# EAGLE design garage_monitor (EAGLE 6.4)
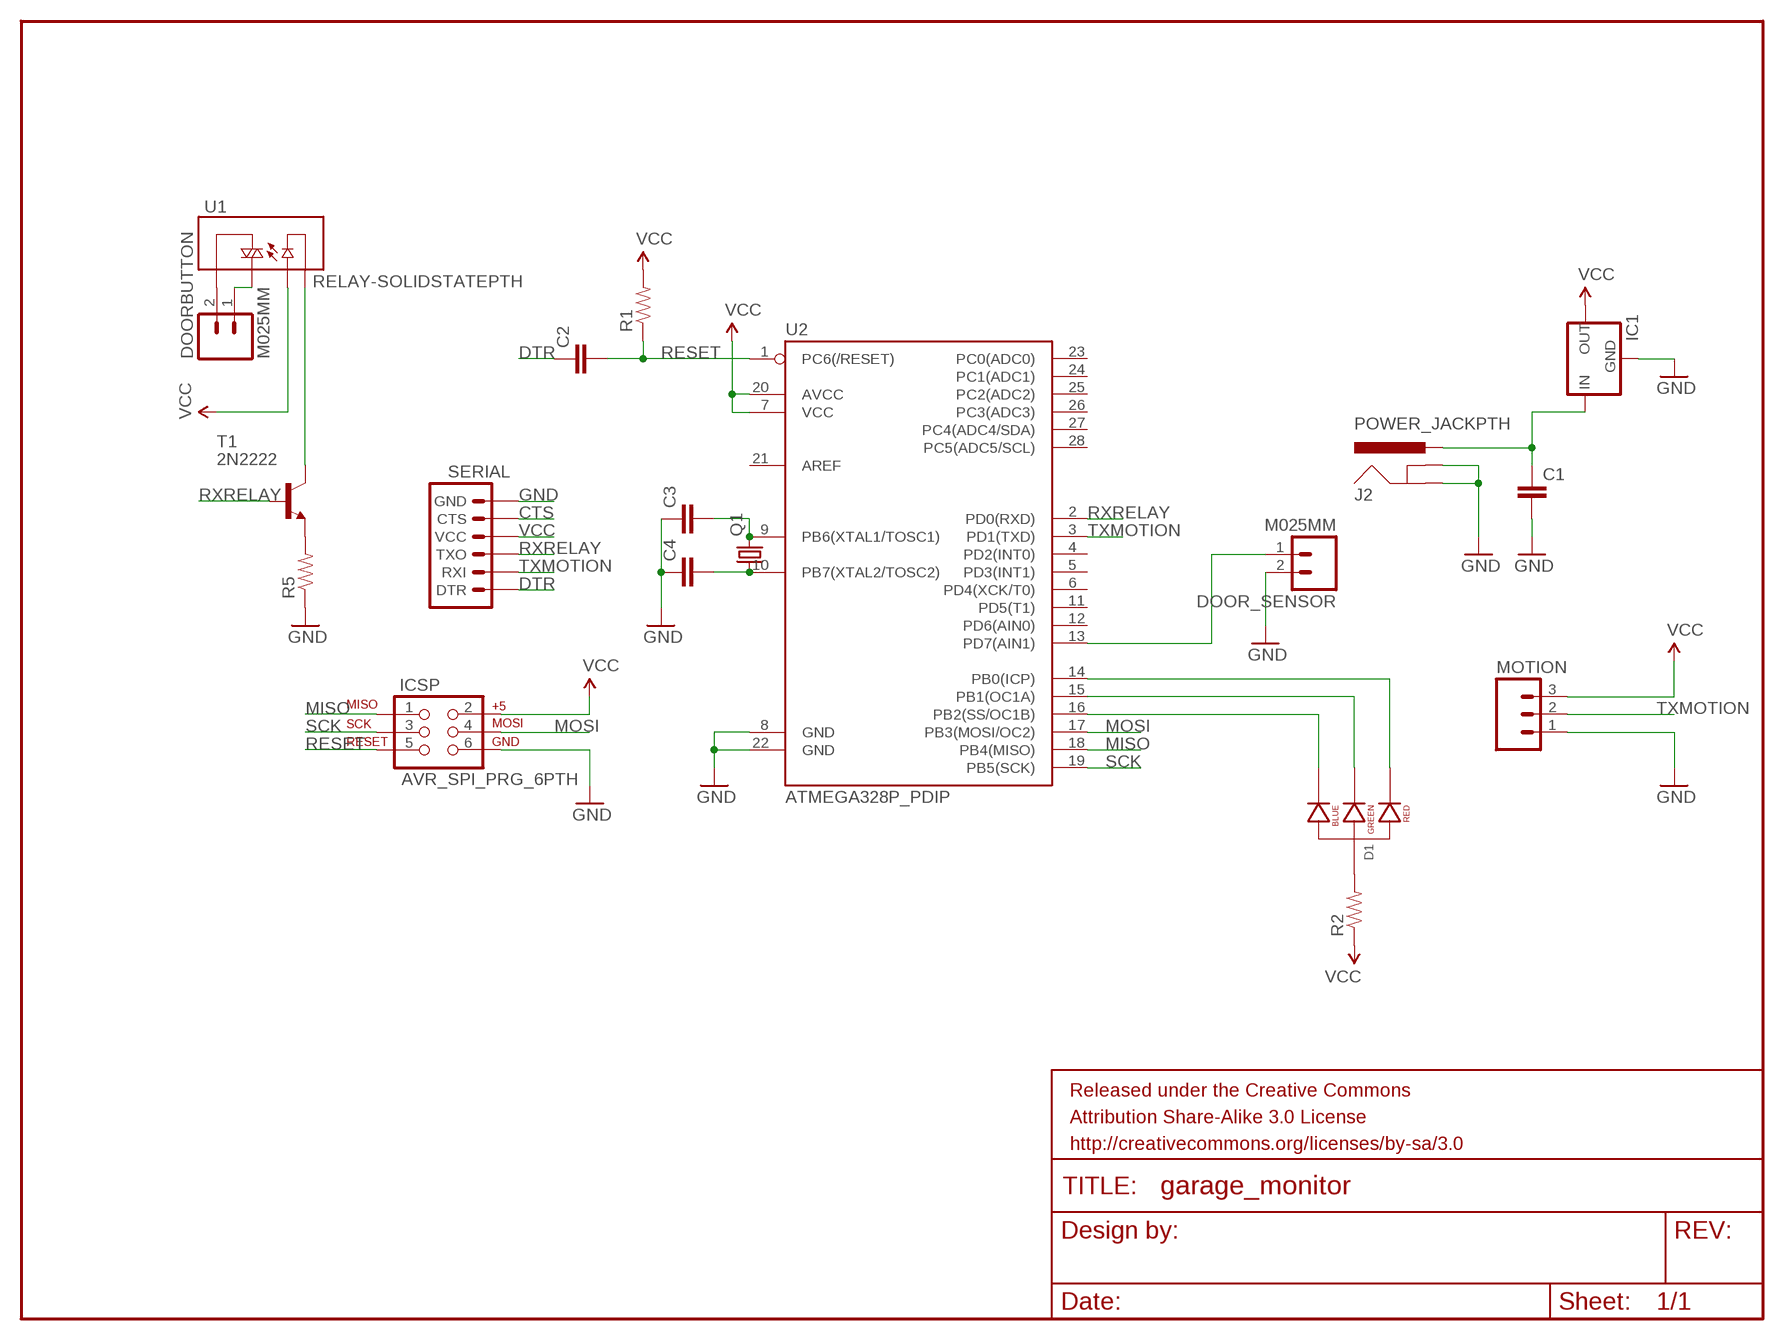
[diagram p0: schematic, sheet 1]

## Parts
C1  CAPPTH  [CAP-PTH-SMALL]
C2  CAPPTH  [CAP-PTH-SMALL]
C3  CAPEZ  [CAP-PTH-SMALLEZ]
C4  CAPEZ  [CAP-PTH-SMALLEZ]
D1  LED-RGB-CA-THRUCLEAR  [LED-RGB-THRU]
DOOR_SENSOR  M025MM  [SCREWTERMINAL-5MM-2]
DOORBUTTON  M025MM  [SCREWTERMINAL-5MM-2]
FRAME1  FRAME-LETTER  [CREATIVE_COMMONS]
IC1  V_REG_78XXSIDE  [78XXL]
ICSP  AVR_SPI_PRG_6PTH  [2X3]
J2  POWER_JACKPTH  [POWER_JACK_PTH]
MOTION  M03PTH  [1X03]
Q1  CRYSTALHC49S  [HC49/S]
R1  RESISTORPTH-1/4W  [AXIAL-0.4]
R2  RESISTORPTH-1/4W  [AXIAL-0.4]
R5  RESISTORPTH-1/4W  [AXIAL-0.4]
SERIAL  ARDUINO_SERIAL_PROGRAMPTH  [1X06]
T1  2N2222  [TO18]
U1  RELAY-SOLIDSTATEPTH  [RELAY-S108T02]
U2  ATMEGA328P_PDIP  [DIL28-3]

## Nets
CTS: SERIAL.5(CTS)
DTR: C2.1 SERIAL.1(DTR)
GND: C1.2 C3.1 C4.1 DOOR_SENSOR.2 IC1.GND ICSP.6 J2.GND J2.GNDBREAK MOTION.1 R5.P$1 SERIAL.6(GND) U2.8(GND) U2.22(GND)
MISO: ICSP.1 U2.18(PB4(MISO))
MOSI: ICSP.4 U2.17(PB3(MOSI/OC2))
N$1: DOOR_SENSOR.1 U2.13(PD7(AIN1))
N$2: R5.P$2 T1.1(E)
N$3: T1.3(C) U1.4(-)
N$8: D1.2(ANODE) R2.P$2
N$9: C3.2 Q1.2 U2.9(PB6(XTAL1/TOSC1))
N$10: C4.2 Q1.1 U2.10(PB7(XTAL2/TOSC2))
N$11: D1.4(BLUE_CATHODE) U2.16(PB2(SS/OC1B))
N$12: D1.3(GREEN_CATHODE) U2.15(PB1(OC1A))
N$13: D1.1(RED_CATHODE) U2.14(PB0(ICP))
N$15: DOORBUTTON.2 U1.1(T1)
N$16: DOORBUTTON.1 U1.2(T2)
N$18: C1.1 IC1.IN J2.PWR
RESET: C2.2 ICSP.5 R1.P$1 U2.1(PC6(/RESET))
RXRELAY: SERIAL.3(TXO) T1.2(B) U2.2(PD0(RXD))
SCK: ICSP.3 U2.19(PB5(SCK))
TXMOTION: MOTION.2 SERIAL.2(RXI) U2.3(PD1(TXD))
VCC: IC1.OUT ICSP.2 MOTION.3 R1.P$2 R2.P$1 SERIAL.4(VCC) U1.3(+) U2.7(VCC) U2.20(AVCC)
Unconnected: U2.4(PD2(INT0)) U2.5(PD3(INT1)) U2.6(PD4(XCK/T0)) U2.11(PD5(T1)) U2.12(PD6(AIN0)) U2.21(AREF) U2.23(PC0(ADC0)) U2.24(PC1(ADC1)) U2.25(PC2(ADC2)) U2.26(PC3(ADC3)) U2.27(PC4(ADC4/SDA)) U2.28(PC5(ADC5/SCL))

## Library data of the parts
C1-C4 = SparkFun-Capacitors:CAP: Capacitor Standard 0603 ceramic capacitor, and 0.1" leaded capacitor.
D1 = SparkFun-LED:LED-RGB-CA-THRU: RGB Through-hole common anode SparkFun store front COM-10821 (diffuse) COM-10820 (clear); PROD_ID: DIO-10631
DOOR_SENSOR DOORBUTTON = SparkFun-Connectors:M02: Standard 2-pin 0.1" header. Use with - straight break away headers ( PRT-00116) - right angle break away headers (PRT-00553) - swiss pins (PRT-00743) - machine pins (PRT-00117) - female headers (PRT-00115) Molex polarized connector foot print use with: PRT-08233 with associated crimp pins and housings. 2.54_SCREWTERM for use with PRT-10571. 3.5mm Screw Terminal footprints for PRT-08084 5mm Screw Terminal footprints for use with PRT-08433
FRAME1 = SparkFun-Aesthetics:FRAME-LETTER: Schematic Frame Standard 8.5x11 US Letter frame
IC1 = SparkFun-PowerIC:V_REG_78XX: Voltage Regulator Standard 7805 5V regulator. IGO (Input Ground Output). Spark Fun Electronics SKU : COM-00107
ICSP = SparkFun-Connectors:AVR_SPI_PRG_6: AVR ISP 6 Pin This is the reduced ISP connector for AVR programming. Common on Arduino. This footprint will take up less PCB space and can be used with a 10-pin to 6-pin adapter such as SKU: BOB-08508
J2 = SparkFun-Connectors:POWER_JACK: Power Jack This is the standard 5.5mm barrel jack for power. The PTH is the most common, proven, reliable, footprint. The Slot footprint only works if the mill layer is transmitted to the PCB fab house so be warned. Mating wall wart : TOL-00298 (and others); PROD_ID: PRT-00119
MOTION = SparkFun-Connectors:M03: Header 3 Standard 3-pin 0.1" header. Use with straight break away headers (SKU : PRT-00116), right angle break away headers (PRT-00553), swiss pins (PRT-00743), machine pins (PRT-00117), and female headers (PRT-00115). Molex polarized connector foot print use with SKU : PRT-08232 with associated crimp pins and housings.
Q1 = crystal:CRYSTAL: CRYSTAL; OC_FARNELL: 1667008; OC_NEWARK: unknown
R1 R2 R5 = SparkFun-Resistors:RESISTOR: Resistor Basic schematic elements and footprints for 0603, 1206, and PTH resistors.
SERIAL = SparkFun-Connectors:ARDUINO_SERIAL_PROGRAM: FTDI connector footprints
T1 = transistor:2N2222: NPN TRANSISTOR
U1 = SparkFun-Electromechanical:RELAY-SOLIDSTATE: SPST SS relay
U2 = SparkFun-DigitalIC:ATMEGA328P_PDIP: uC used in the Arduino 32kb flash, 1k EEPROM, 2k SRAM This is the through-hole version of this chip.

## Board
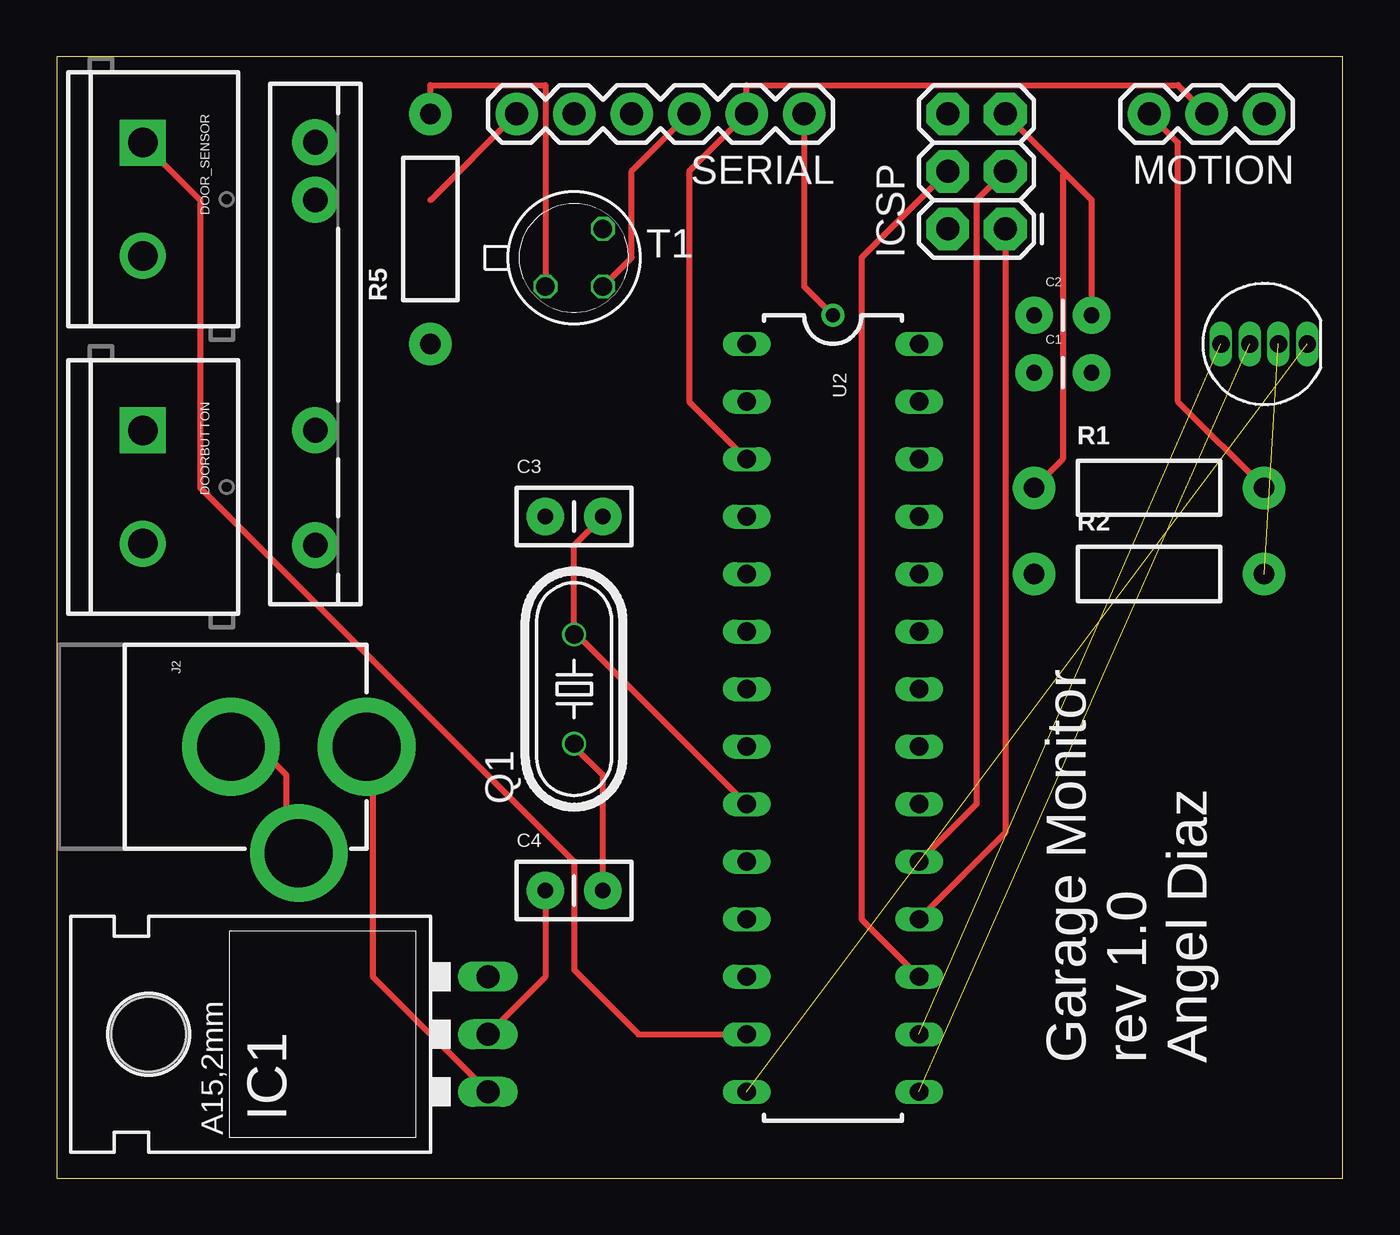
[diagram p1: board, top side]
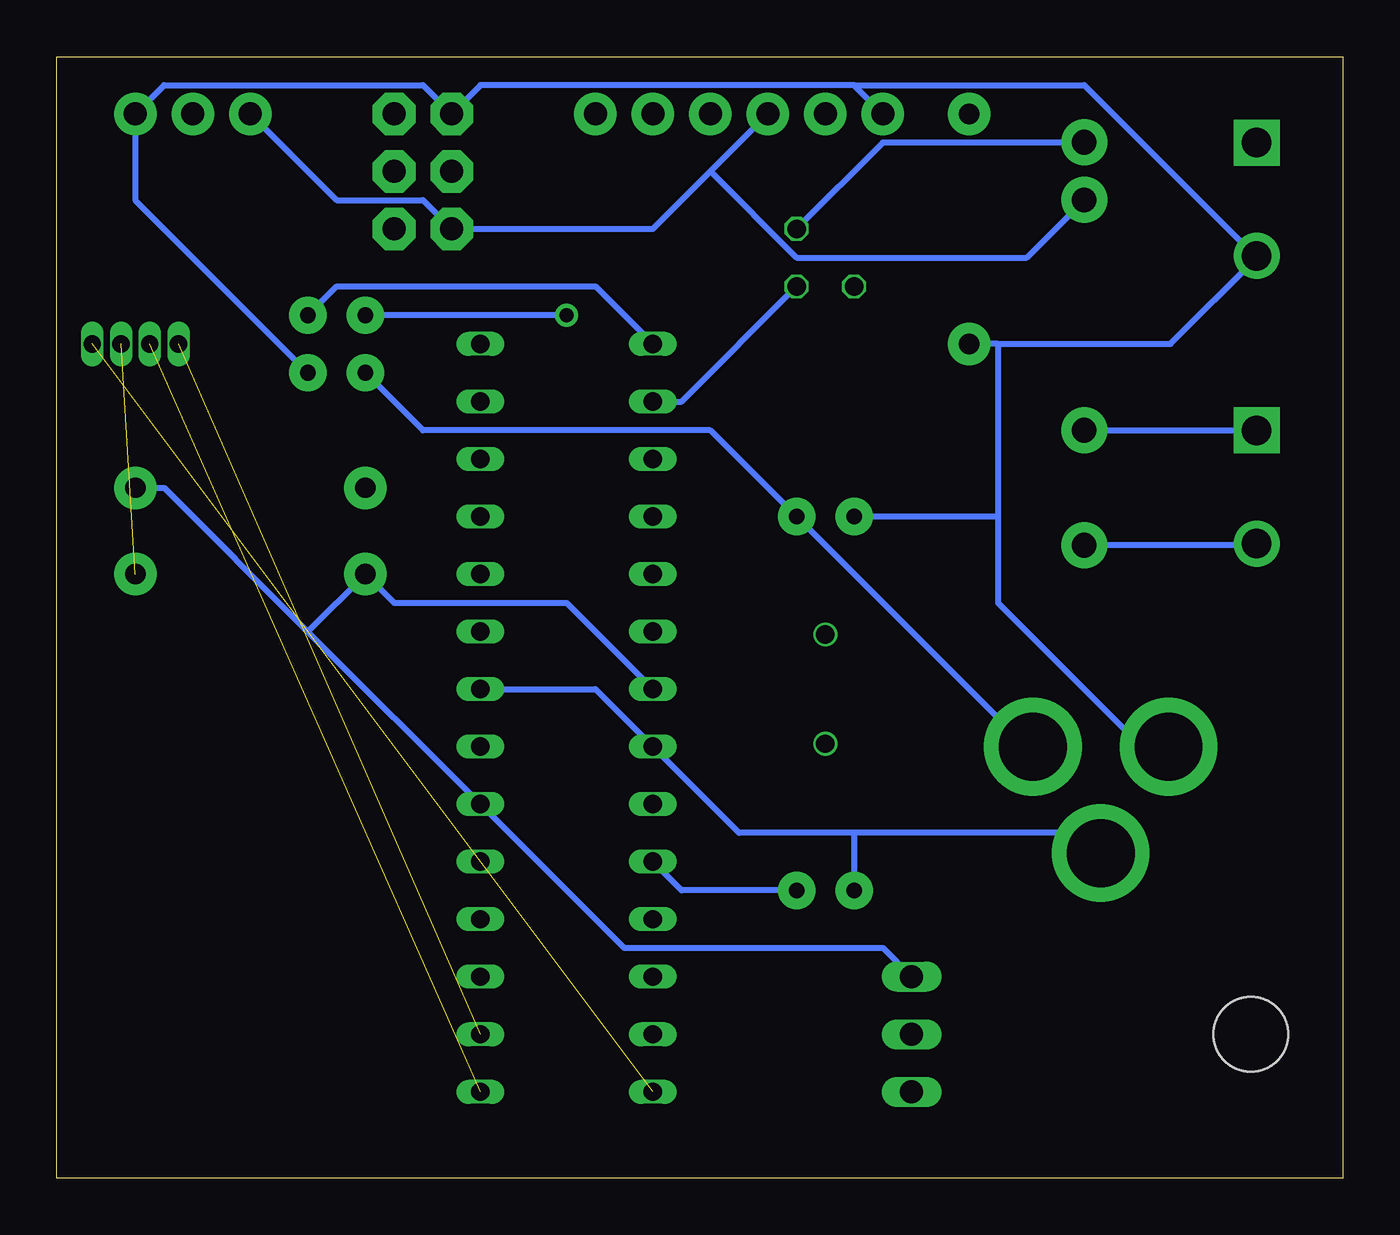
[diagram p2: board, bottom side, seen from below]

Size 56.82 x 49.52 mm. Coordinates in mm from the lower left corner, seen from the top.
Outline: 0,0 56.82,0 56.82,49.52 0,49.52 0,0
Copper layers (1*16): Top 0.035mm / dielectric 1.5mm / Bottom 0.035mm
Design rules "default *": minimum track width 10mil, minimum drill 24mil, track to track 8mil, track to pad 8mil, pad to pad 8mil, via to via 8mil, smd to smd 8mil, copper to edge 40mil, drill to drill 8mil, minimum pad ring 0mil, minimum via ring 8mil, stop-mask expansion 4mil, vias tented up to drill 0mil, thermal gap 10mil

### Footprints (pad centres in the part's own frame; a part is rotated, then mirrored left to right if it is on the bottom)
CAP-PTH-SMALL = drill 0.7 pad 1.651: 1 0,0; 2 2.54,0
CAP-PTH-SMALLEZ = drill 0.7 pad 1.651: 1 0,0; 2 2.54,0
LED-RGB-THRU = drill 0.762 pad 0.889 long: 1 1.905,0; 2 0.635,0; 3 -0.635,0; 4 -1.905,0
SCREWTERMINAL-5MM-2 = drill 1.3 pad 2.032 square: 1 0,0 | drill 1.3 pad 2.032: 2 5,0
78XXL = drill 1.016 long: GND 0,-3.81; IN -2.54,-3.81; OUT 2.54,-3.81 | hole 3.302: 0,11.176
2X3 = drill 1.016 pad 1.88 octagon: 1 0,0; 2 0,2.54; 3 2.54,0; 4 2.54,2.54; 5 5.08,0; 6 5.08,2.54
POWER_JACK_PTH = drill 2.997 pad 4.318: GND 0,7.7; GNDBREAK 4.7,10.7; PWR 0,13.7
1X03 = drill 1.016 pad 1.88: 1 0,0; 2 2.54,0; 3 5.08,0
HC49/S = drill 0.813: 1 -2.413,0; 2 2.413,0
AXIAL-0.4 = drill 0.9 pad 1.88: P$1 -5.08,0; P$2 5.08,0
1X06 = drill 1.016 pad 1.88: 1 0,0; 2 2.54,0; 3 5.08,0; 4 7.62,0; 5 10.16,0; 6 12.7,0
TO18 = drill 0.813 octagon: 1 -1.27,-1.27; 2 1.27,-1.27; 3 1.27,1.27
RELAY-S108T02 = drill 1.1 pad 2.032: 1 -8.88,0; 2 -3.8,0; 3 6.36,0; 4 8.9,0
DIL28-3 = drill 0.813 long: 1 -16.51,-3.81; 2 -13.97,-3.81; 3 -11.43,-3.81; 4 -8.89,-3.81; 5 -6.35,-3.81; 6 -3.81,-3.81; 7 -1.27,-3.81; 8 1.27,-3.81; 9 3.81,-3.81; 10 6.35,-3.81; 11 8.89,-3.81; 12 11.43,-3.81; 13 13.97,-3.81; 14 16.51,-3.81; 15 16.51,3.81; 16 13.97,3.81; 17 11.43,3.81; 18 8.89,3.81; 19 6.35,3.81; 20 3.81,3.81; 21 1.27,3.81; 22 -1.27,3.81; 23 -3.81,3.81; 24 -6.35,3.81; 25 -8.89,3.81; 26 -11.43,3.81; 27 -13.97,3.81; 28 -16.51,3.81

### Placement (x,y rotation side)
C1  43.18,35.56 0 top
C2  43.18,38.1 0 top
C3  21.59,29.21 0 top
C4  21.59,12.7 0 top
D1  53.34,36.83 0 top
DOOR_SENSOR  3.81,45.72 270 top
DOORBUTTON  3.81,33.02 270 top
FRAME1  21.59,-38.1 0 top  (outside the outline)
IC1  15.24,6.35 90 top
ICSP  41.91,41.91 90 top
J2  0,19.05 270 top
MOTION  53.34,46.99 180 top
Q1  22.86,21.59 90 top
R1  48.26,30.48 0 top
R2  48.26,26.67 0 top
R5  16.51,41.91 90 top
SERIAL  33.02,46.99 180 top
T1  22.86,40.64 0 top
U1  11.43,36.83 90 top
U2  34.29,20.32 270 top

### Tracks (layer width: path | path; a pad name or v marks a point on that pad's centre or on a via)
DTR  (via drill 0.61)
  Top 0.254: v34.29,38.1 33.02,39.37 SERIAL.1
  Bottom 0.254: v34.29,38.1 C2.1
GND
  Top 0.254: IC1.GND 21.59,8.89 C4.1 | J2.GND 8.89,19.05 10.16,17.78 10.16,15.24 J2.GNDBREAK | 16.51,43.18 SERIAL.6
  Bottom 0.254: U2.22 33.02,21.59 U2.8 26.67,15.24 21.59,15.24 | 21.59,15.24 11.43,15.24 J2.GNDBREAK | 21.59,15.24 C4.1 | C1.2 53.34,43.18 MOTION.1 52.07,48.26 40.64,48.26 ICSP.6 38.1,48.26 21.59,48.26 | 3.81,40.64 7.62,36.83 15.24,36.83 | SERIAL.6 21.59,48.26 | 15.24,36.83 15.24,29.21 | 15.24,29.21 15.24,25.4 8.89,19.05 J2.GND | 15.24,29.21 C3.1 | 15.24,36.83 R5.P$1 | 3.81,40.64 11.43,48.26 21.59,48.26 | 3.81,40.64 DOOR_SENSOR.2
MISO
  Top 0.254: U2.18 41.91,15.24 ICSP.1
MOSI
  Top 0.254: U2.17 35.56,11.43 35.56,40.64 ICSP.4
N$1
  Top 0.254: U2.13 25.7,6.35 22.86,9.19 22.86,13.97 6.35,30.48 6.35,43.18 DOOR_SENSOR.1
N$2
  Top 0.254: T1.1 21.59,48.26 16.51,48.26 R5.P$2
N$3
  Bottom 0.254: T1.3 20.32,45.72 U1.4
N$8  (1 unrouted)
N$9
  Top 0.254: 22.86,24.13 U2.9 | C3.2 22.86,27.94 22.86,24.13 | 22.86,24.13 Q1.2
N$10
  Top 0.254: C4.2 24.13,17.78 22.86,19.05 Q1.1
  Bottom 0.254: U2.10 29.21,12.7 C4.2
N$11  (1 unrouted)
N$12  (1 unrouted)
N$13  (1 unrouted)
N$15
  Bottom 0.254: U1.1 3.81,27.94 DOORBUTTON.2
N$16
  Bottom 0.254: DOORBUTTON.1 U1.2
N$18
  Top 0.254: IC1.IN 13.97,8.89 13.97,19.05 J2.PWR
  Bottom 0.254: C1.1 40.64,33.02 27.94,33.02 13.97,19.05 J2.PWR
RESET
  Top 0.254: 44.45,44.45 45.72,43.18 C2.2 | 44.45,44.45 ICSP.5 | R1.P$1 44.45,31.75 44.45,44.45
  Bottom 0.254: U2.1 33.02,39.37 44.45,39.37 C2.2
RXRELAY
  Top 0.254: SERIAL.3 25.4,44.45 25.4,40.64 T1.2
  Bottom 0.254: T1.2 29.21,34.29 U2.2
SCK
  Top 0.254: U2.19 40.64,16.51 40.64,43.18 ICSP.3
TXMOTION
  Top 0.254: U2.3 27.94,34.29 27.94,44.45 SERIAL.2 30.48,48.26 49.53,48.26 MOTION.2
VCC
  Top 0.254: MOTION.3 49.53,45.72 49.53,34.29 R1.P$2
  Bottom 0.254: MOTION.3 44.45,43.18 40.64,43.18 ICSP.2 30.48,41.91 27.94,44.45 | 27.94,44.45 SERIAL.4 | 27.94,44.45 24.13,40.64 13.97,40.64 U1.3 | U2.7 34.29,25.4 41.91,25.4 R2.P$1 45.72,24.13 | 45.72,24.13 52.07,30.48 R1.P$2 | 45.72,24.13 U2.20 31.75,10.16 20.32,10.16 IC1.OUT

### Text on the board
_tsilk: Garage Monitor / rev 1.0 / Angel Diaz